# EasyEDA Pro project ProPrj_16-Sep-2025_2025-10-22.epro, schematic OURS PHONE_CONNECTORS_FLIP_2

## Sheets
1 CONNECTORS: Board Name: OURS PHONE_CONNECTORS_FLIP_2; Create Date: 2025-07-15; Page Name: CONNECTORS; Project Name: BackupProjects_abdulrehmanbinafsar_personal_0_20241230; Schematic Name: OURS PHONE_CONNECTORS_FLIP_2; Update Date: 2025-09-09; Add into BOM: yes; Company: Your Company; Convert to PCB: yes; Date: 2024-12-04; Draw By: Abdul Rehman; REV: 1.0; Sheet: 1/1
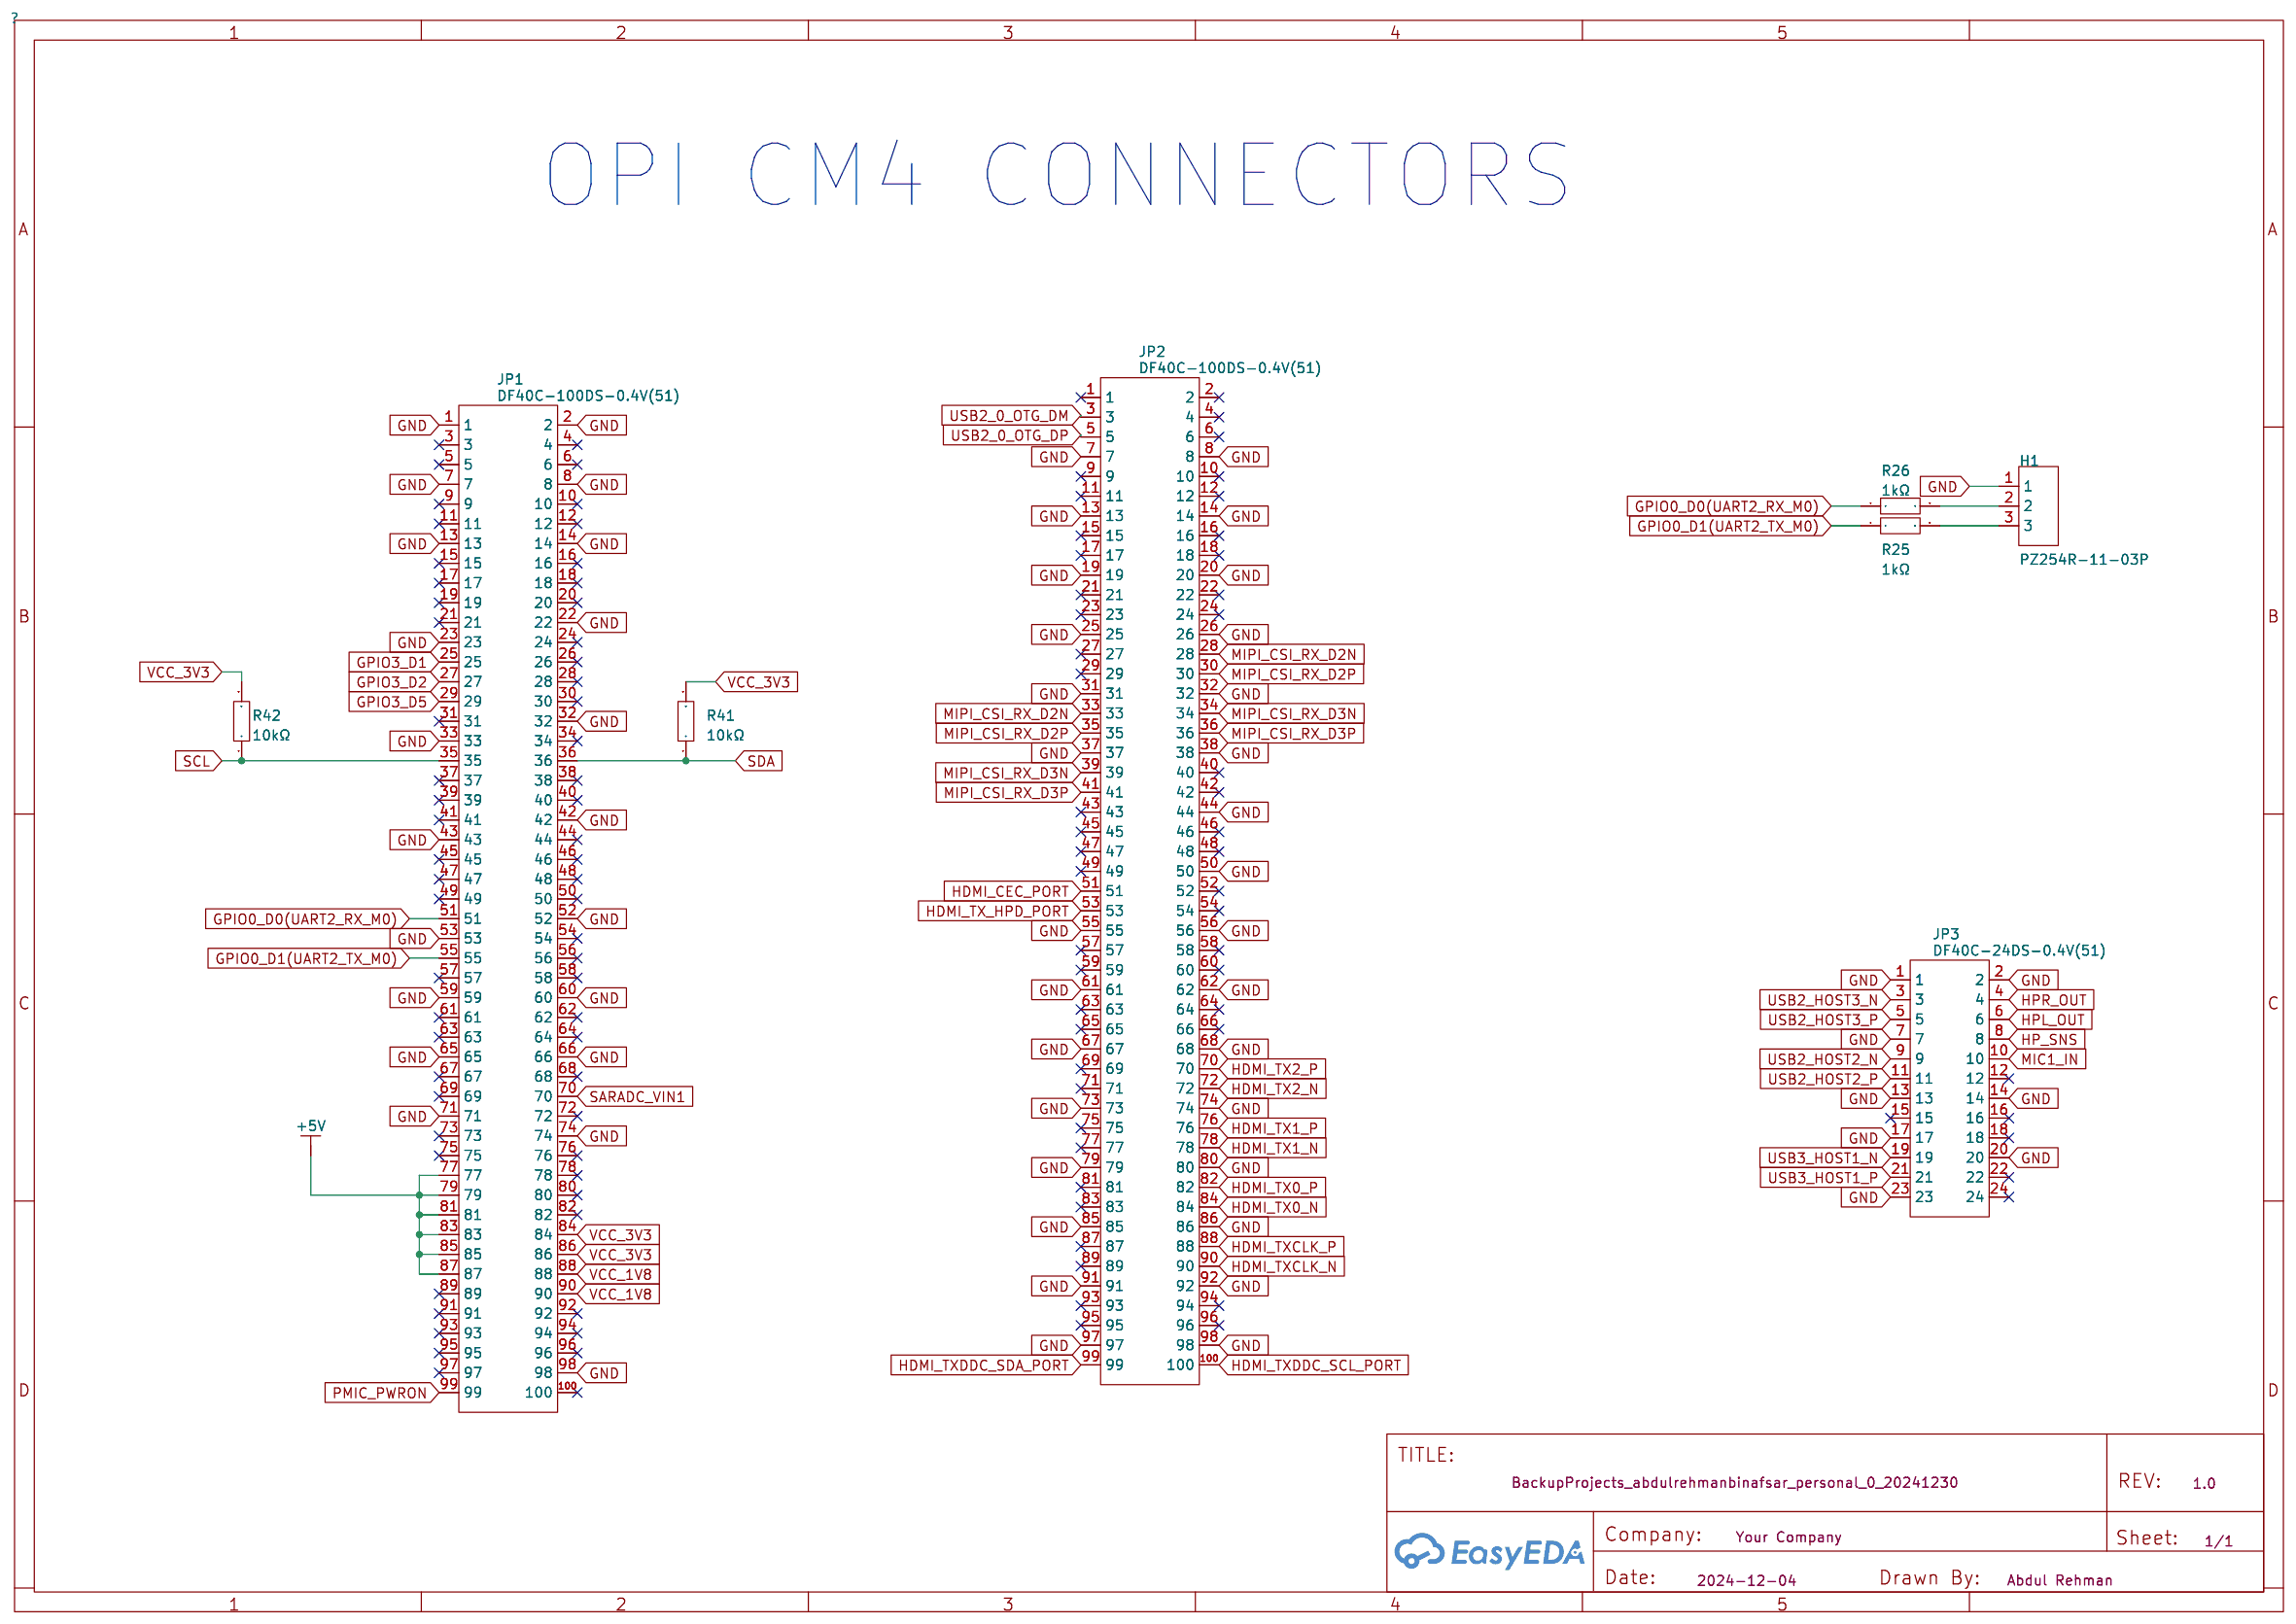
[diagram p0: CONNECTORS]
2 CIRCUITRY: Create Date: 2025-05-14; Page Name: CIRCUITRY; Update Date: 2025-05-29; Date: 2024-12-06
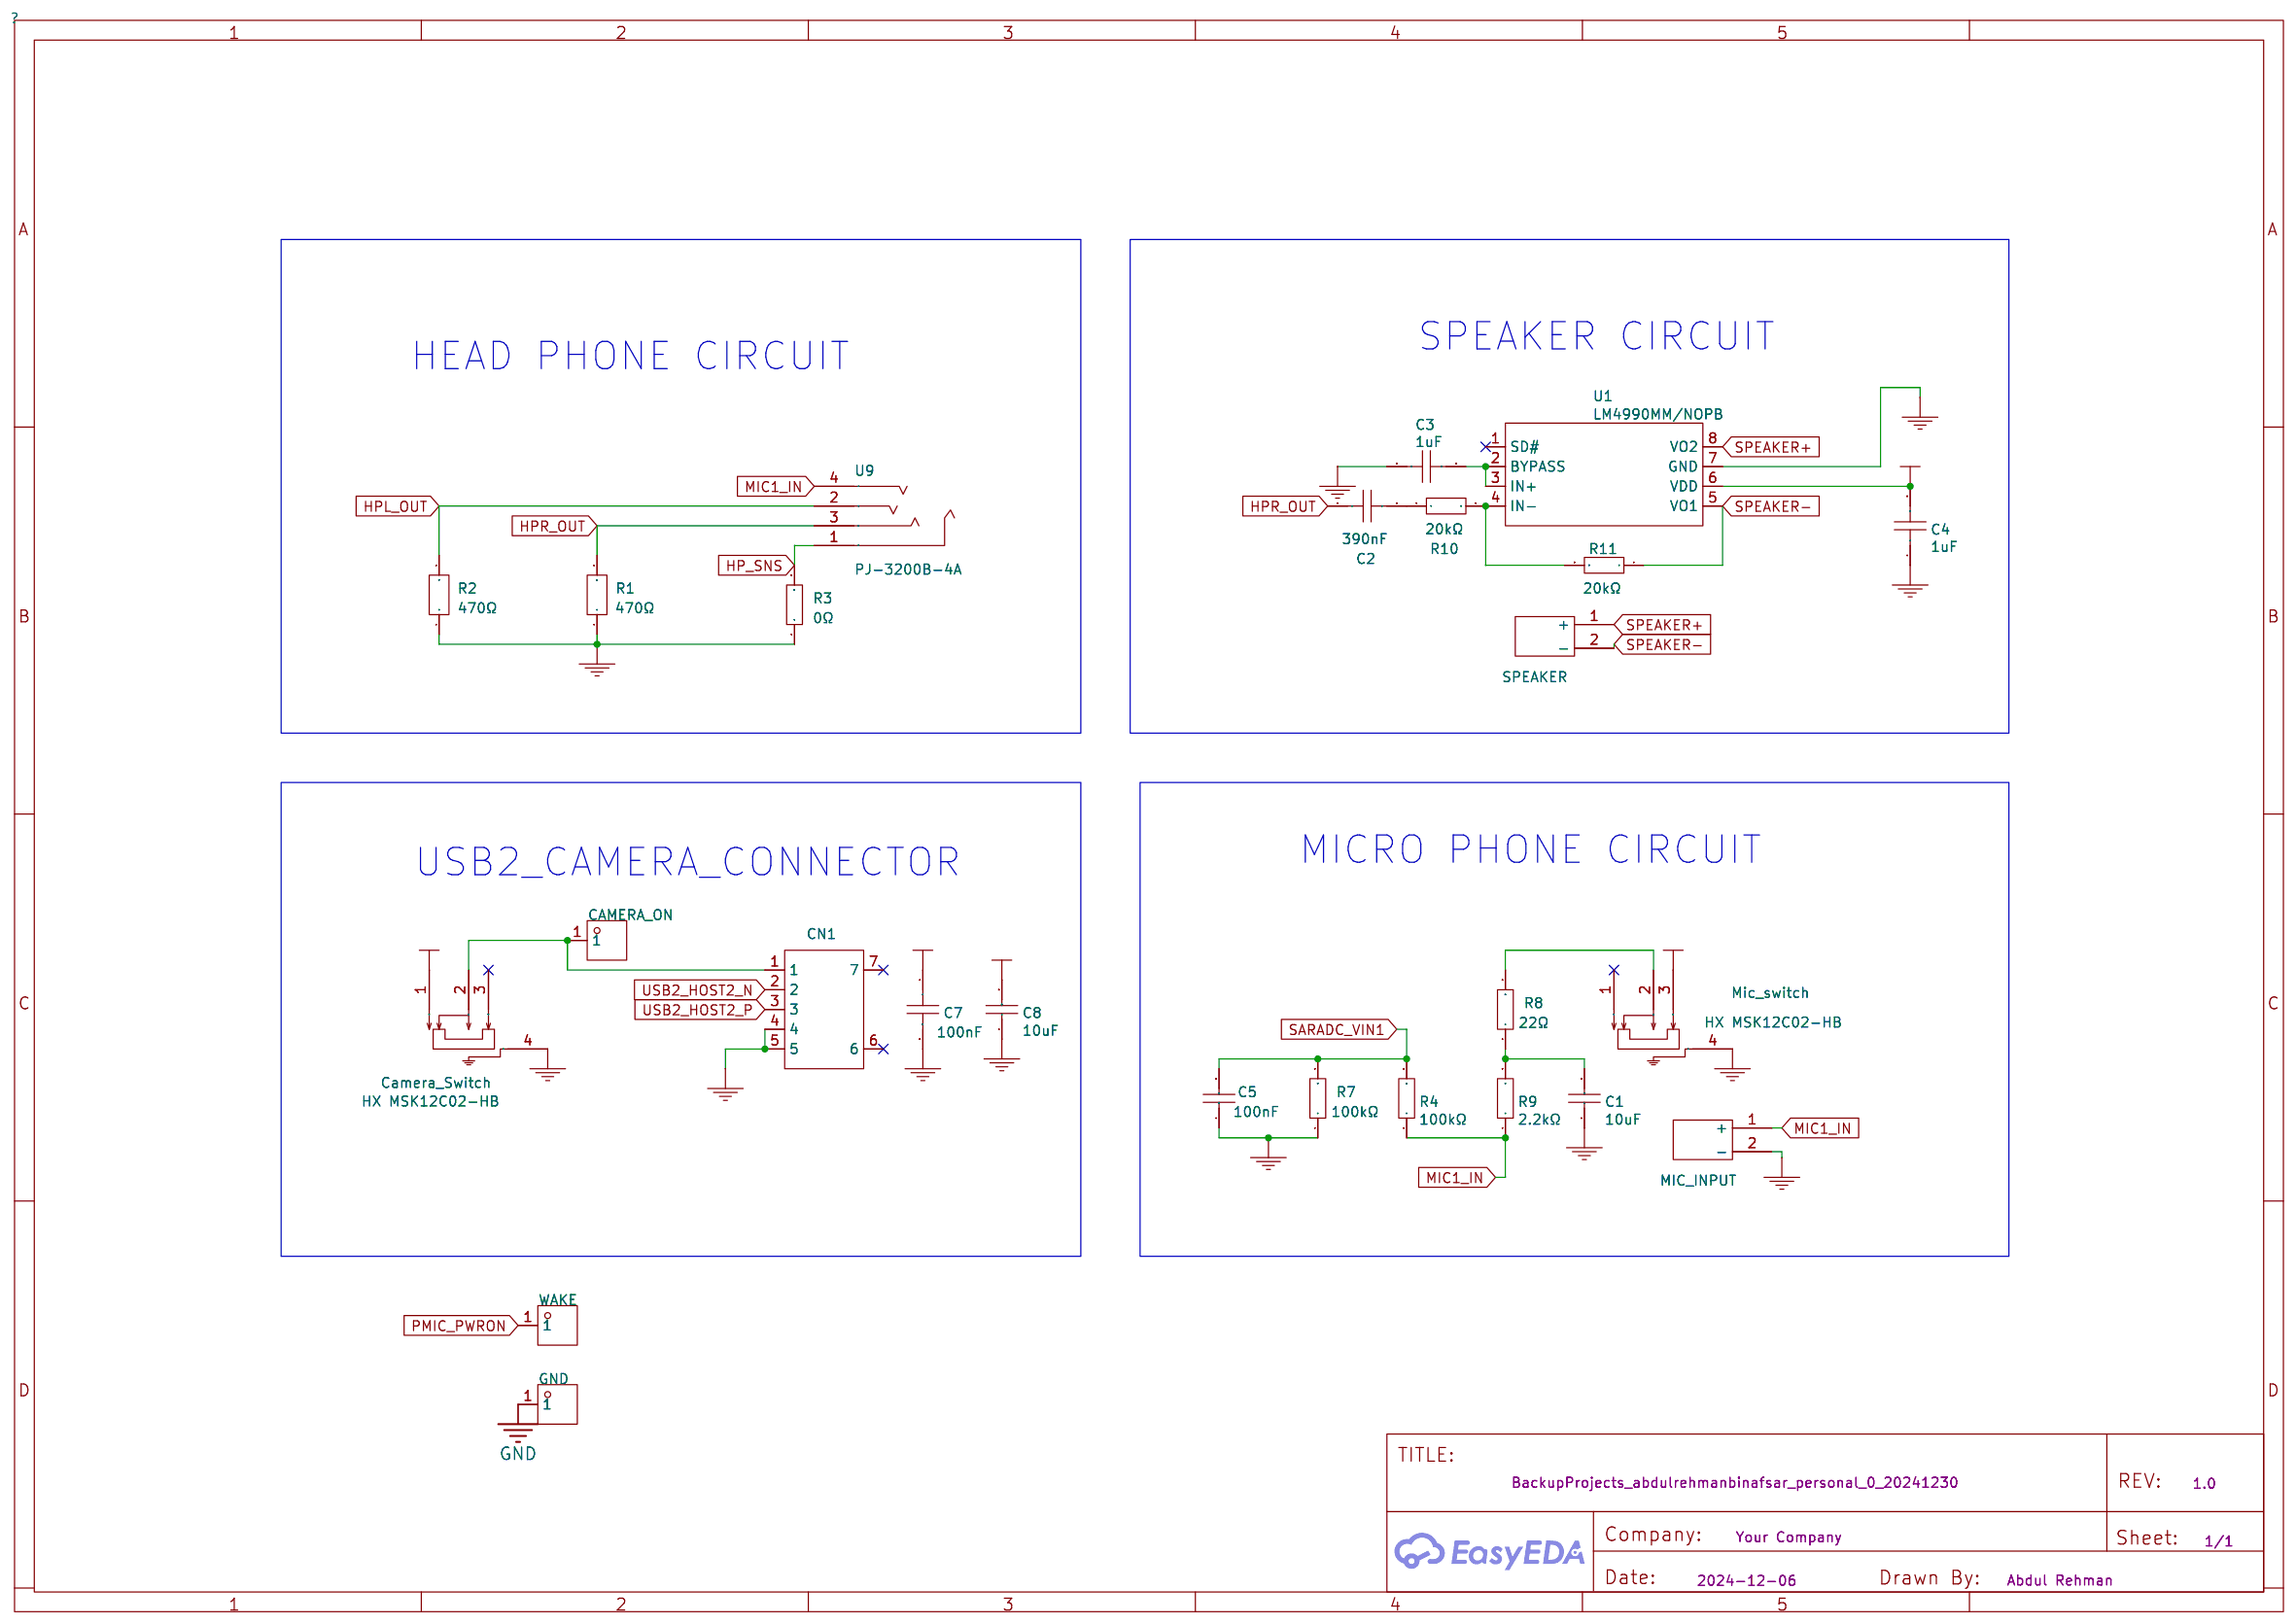
[diagram p1: CIRCUITRY]
3 SIM Module: Page Name: SIM Module; Update Date: 2025-07-15; Date: 2024-12-06
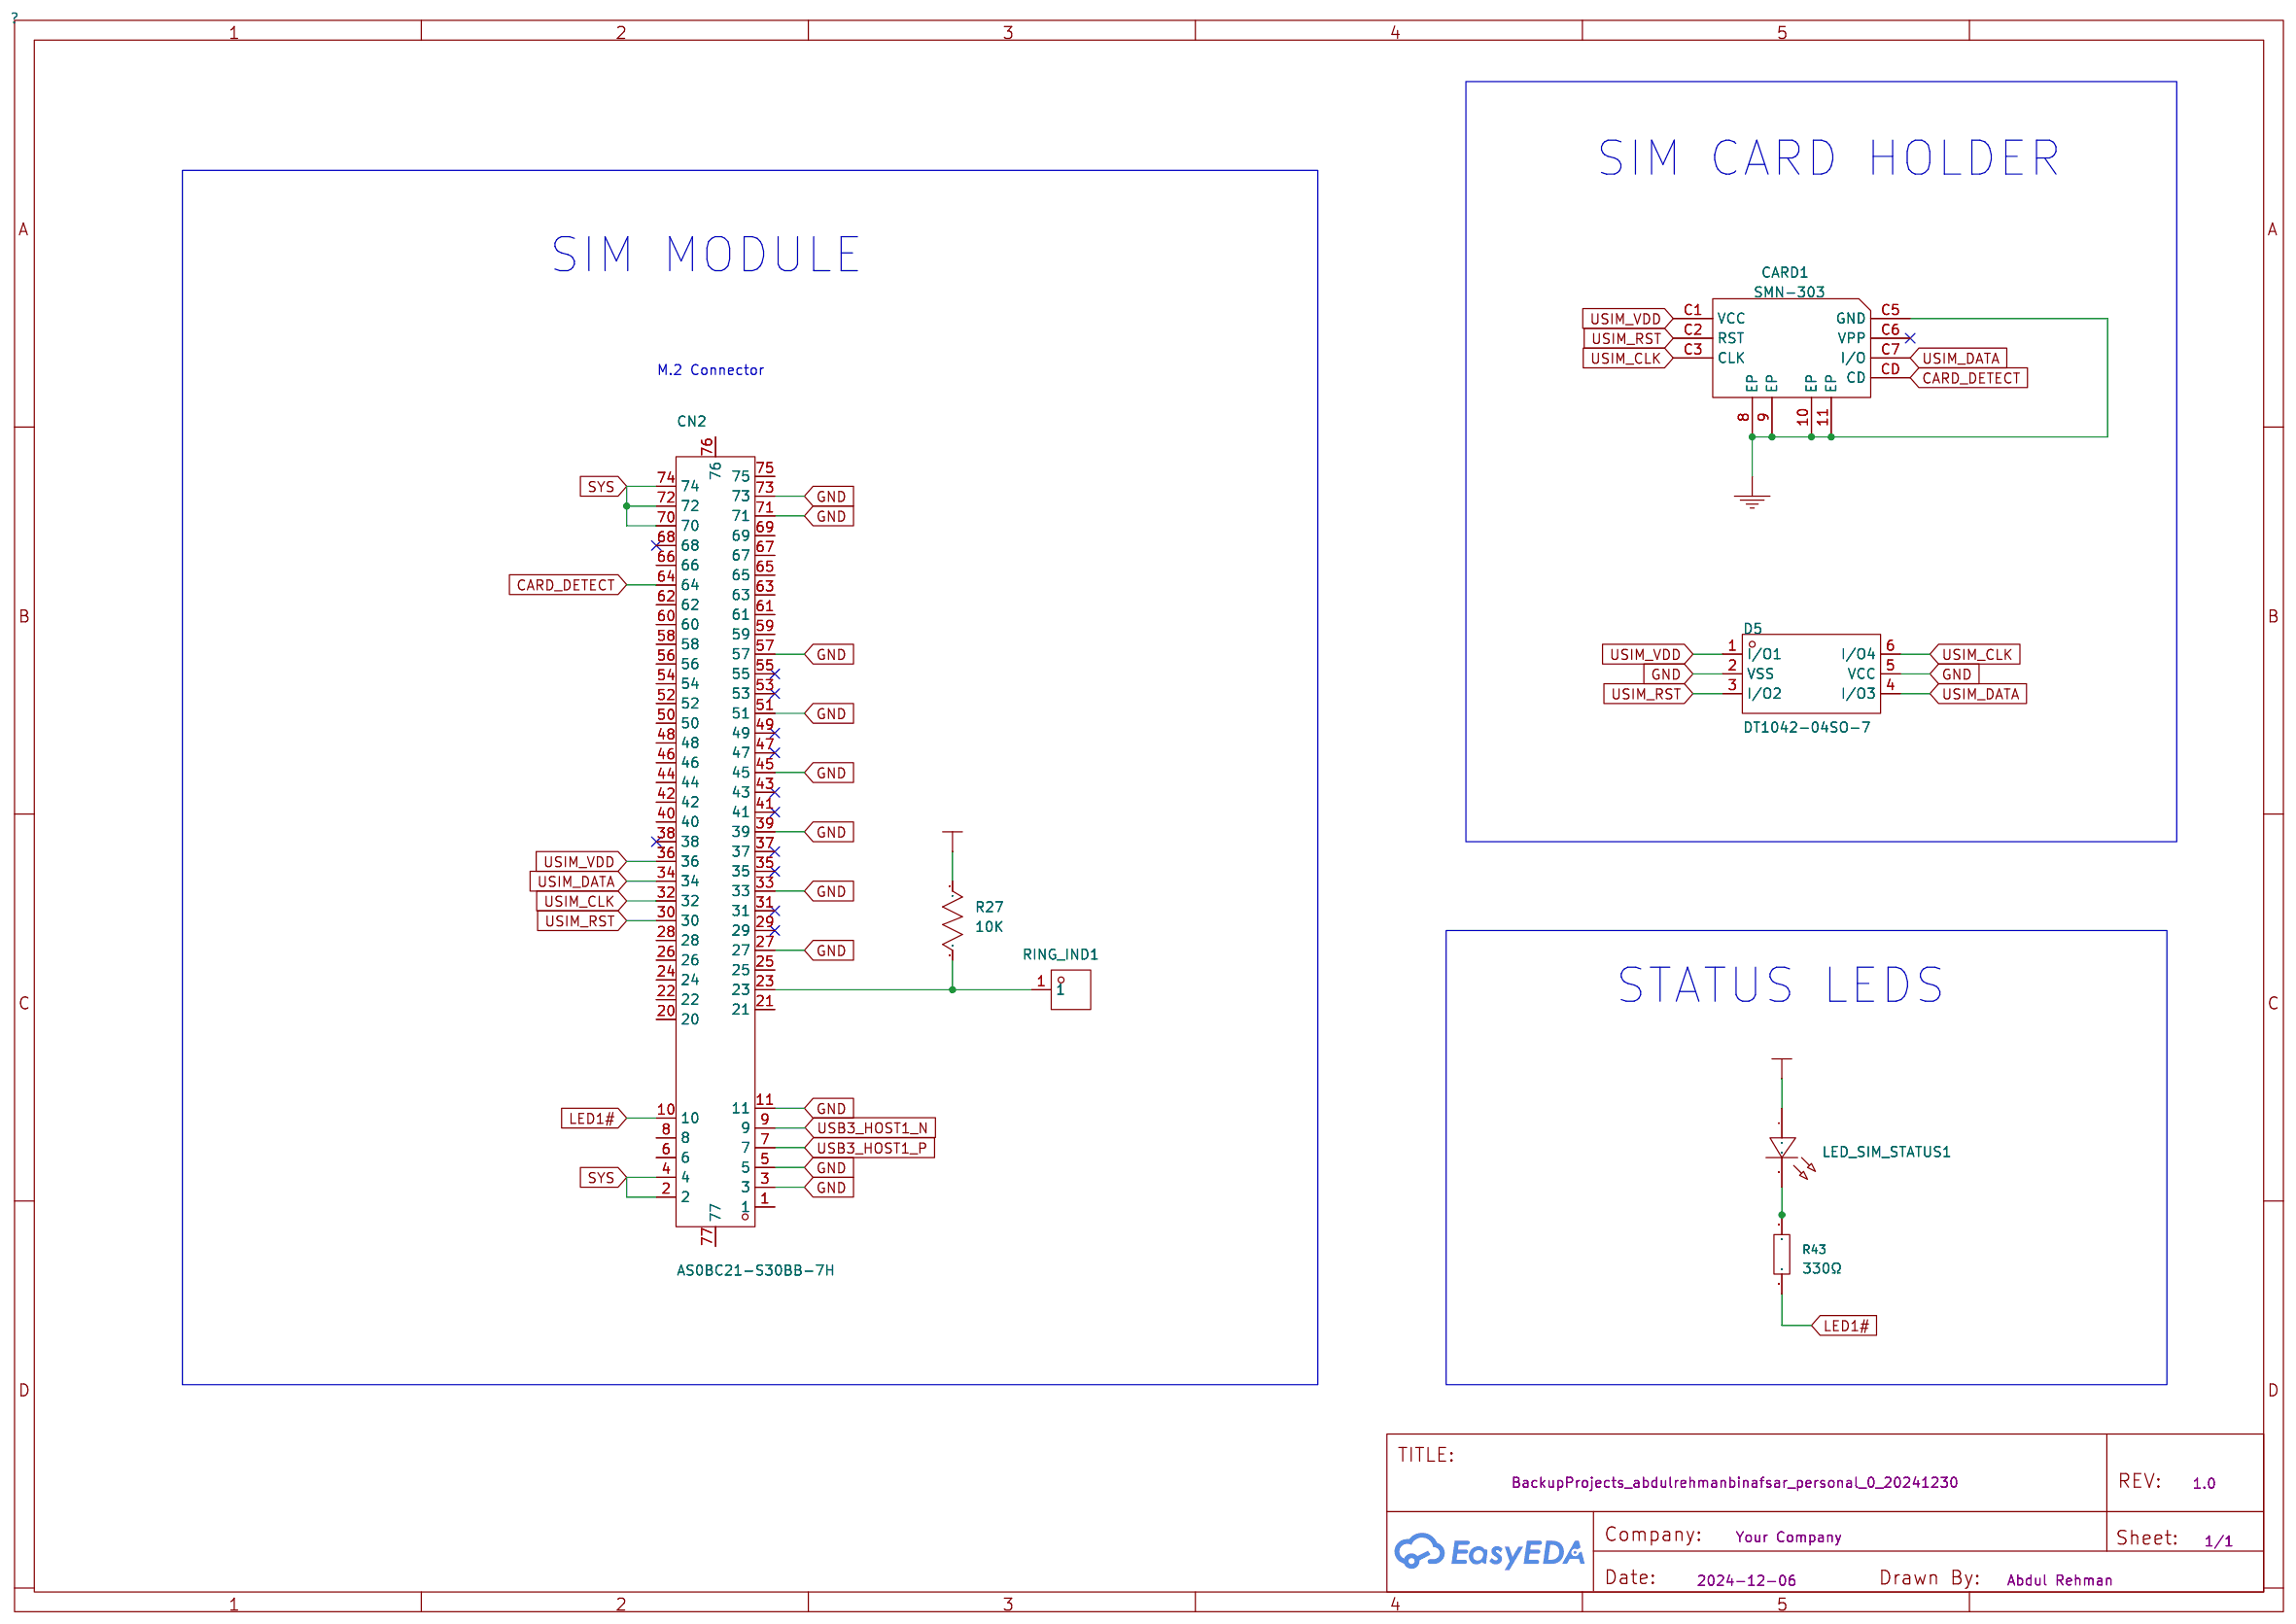
[diagram p2: SIM Module]
4 HDMI PORT: Create Date: 2025-05-14; Page Name: HDMI PORT; Update Date: 2025-05-29; Date: 2024-12-09
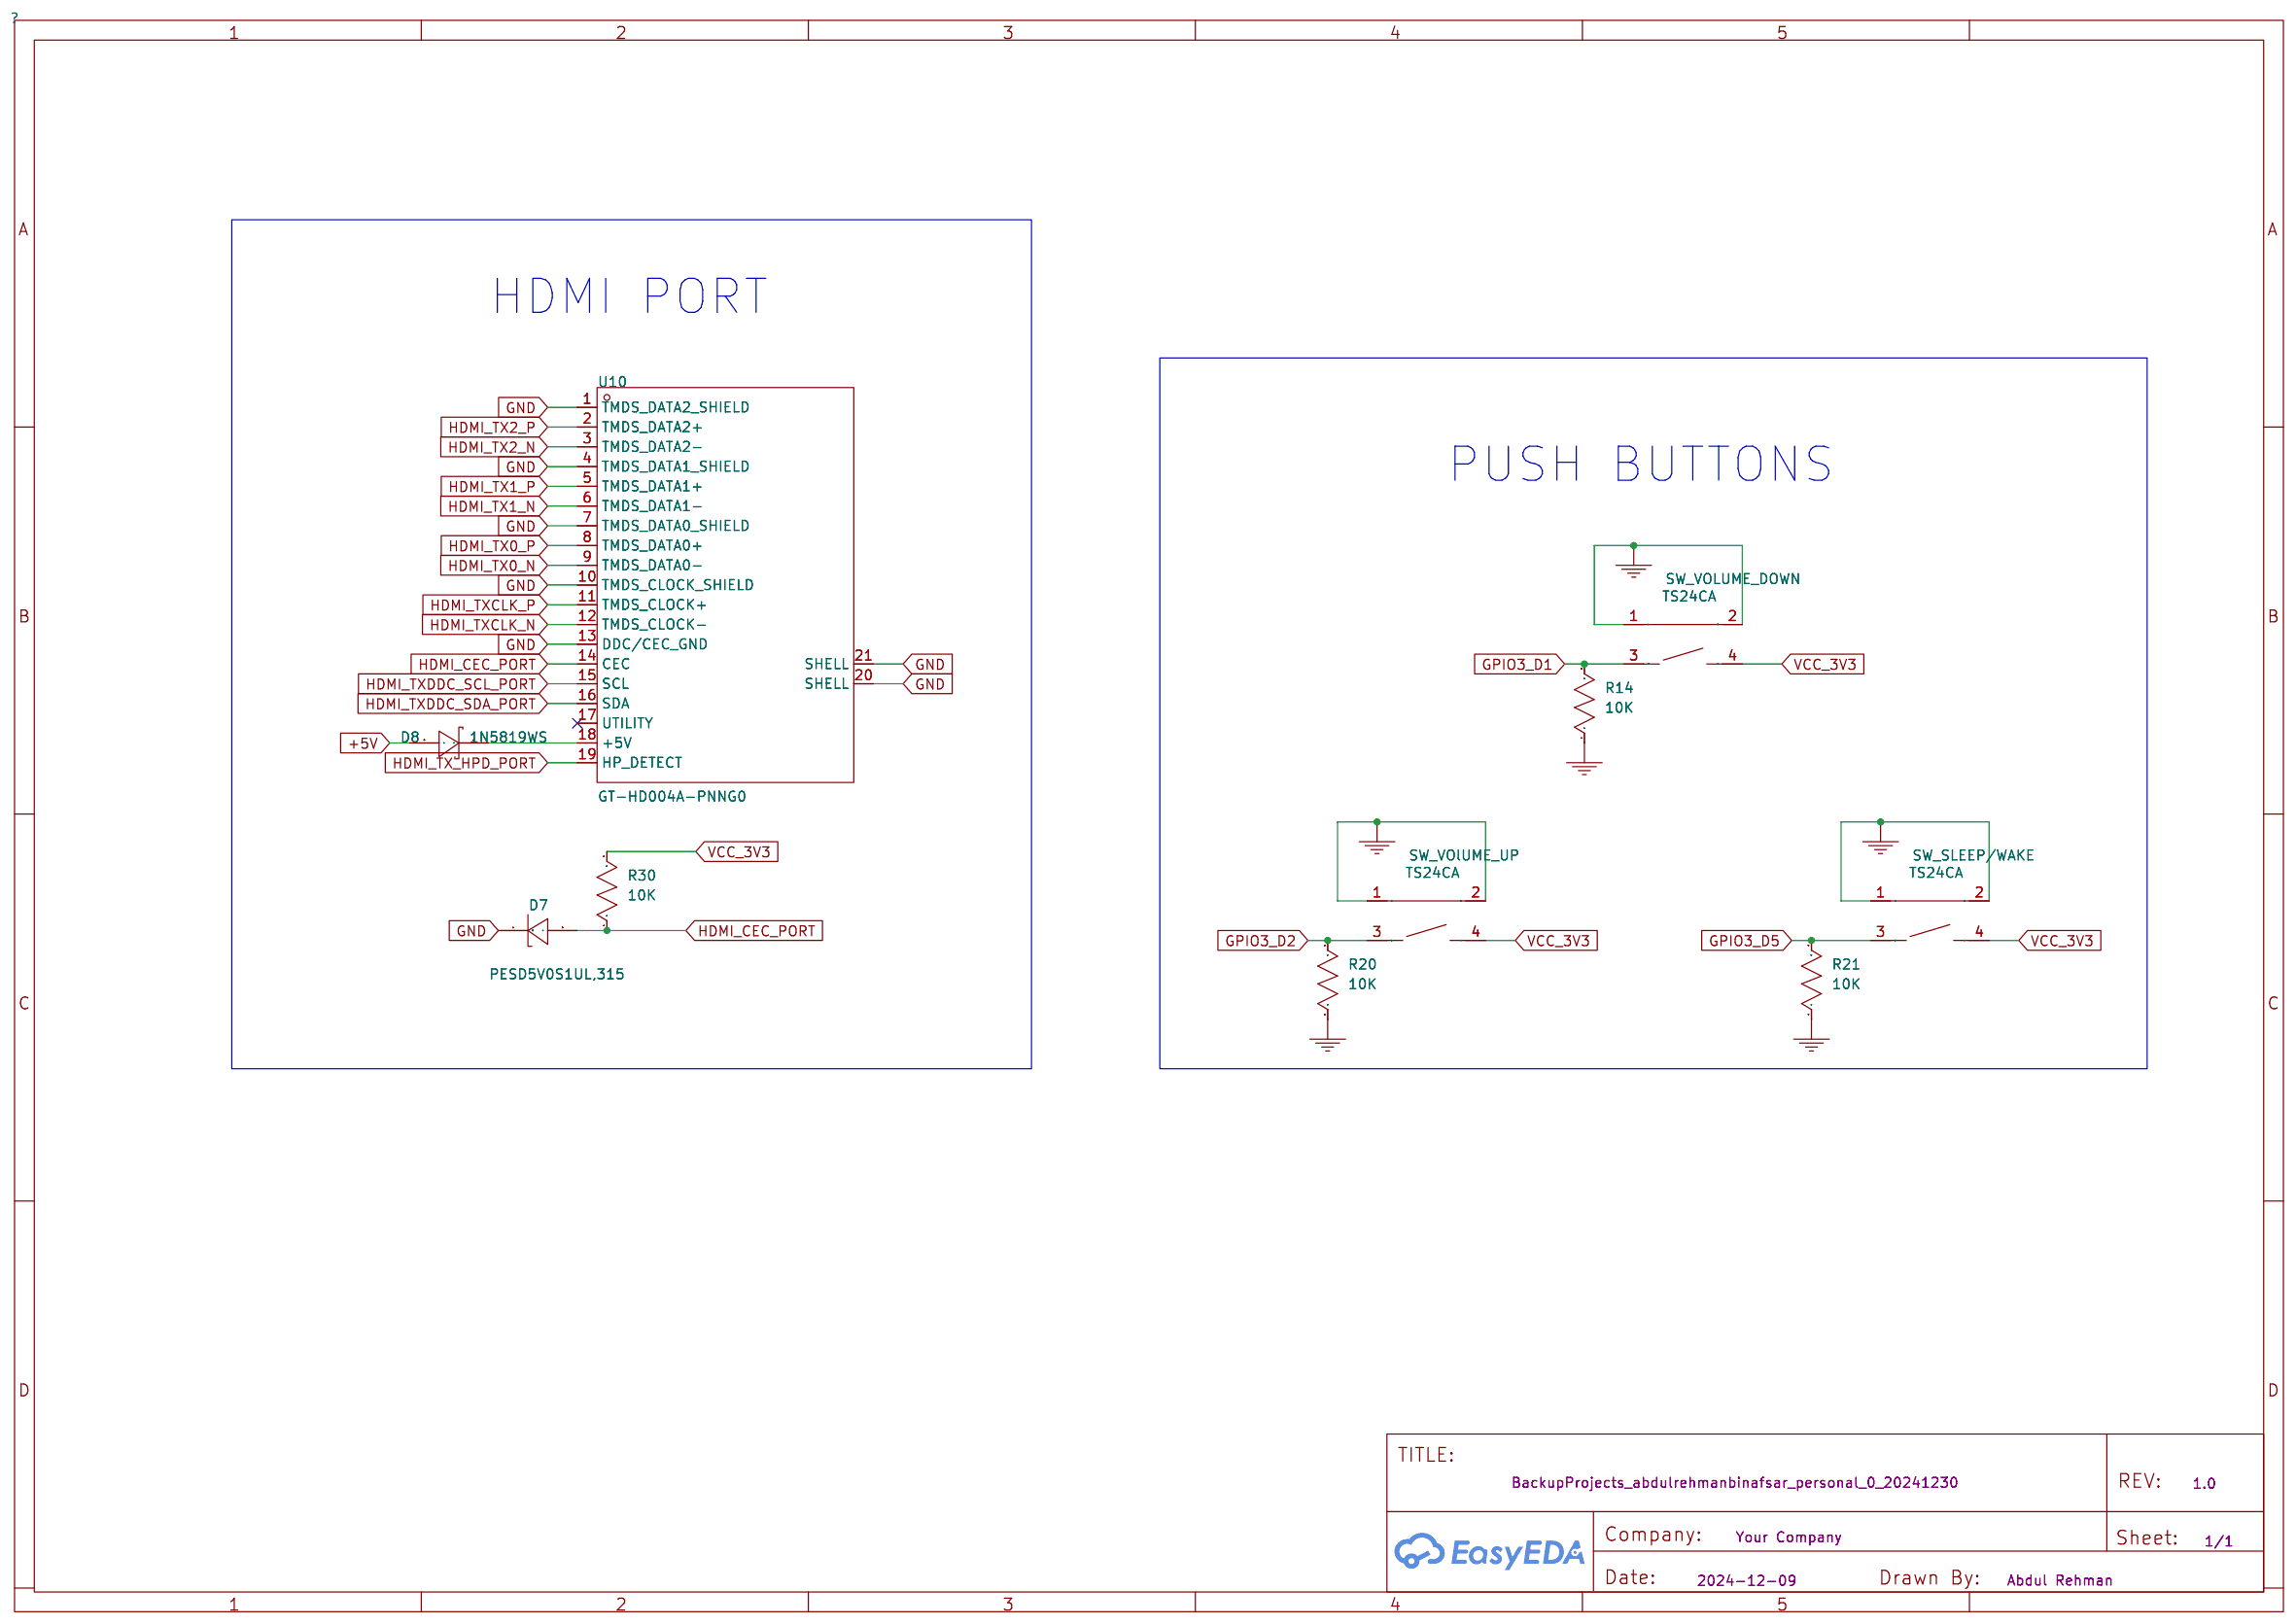
[diagram p3: HDMI PORT]
5 CPBR CIRCUIT: Page Name: CPBR CIRCUIT; Update Date: 2025-09-16; Company: EasyEDA.com; Page Size: A4; Version: V1.0
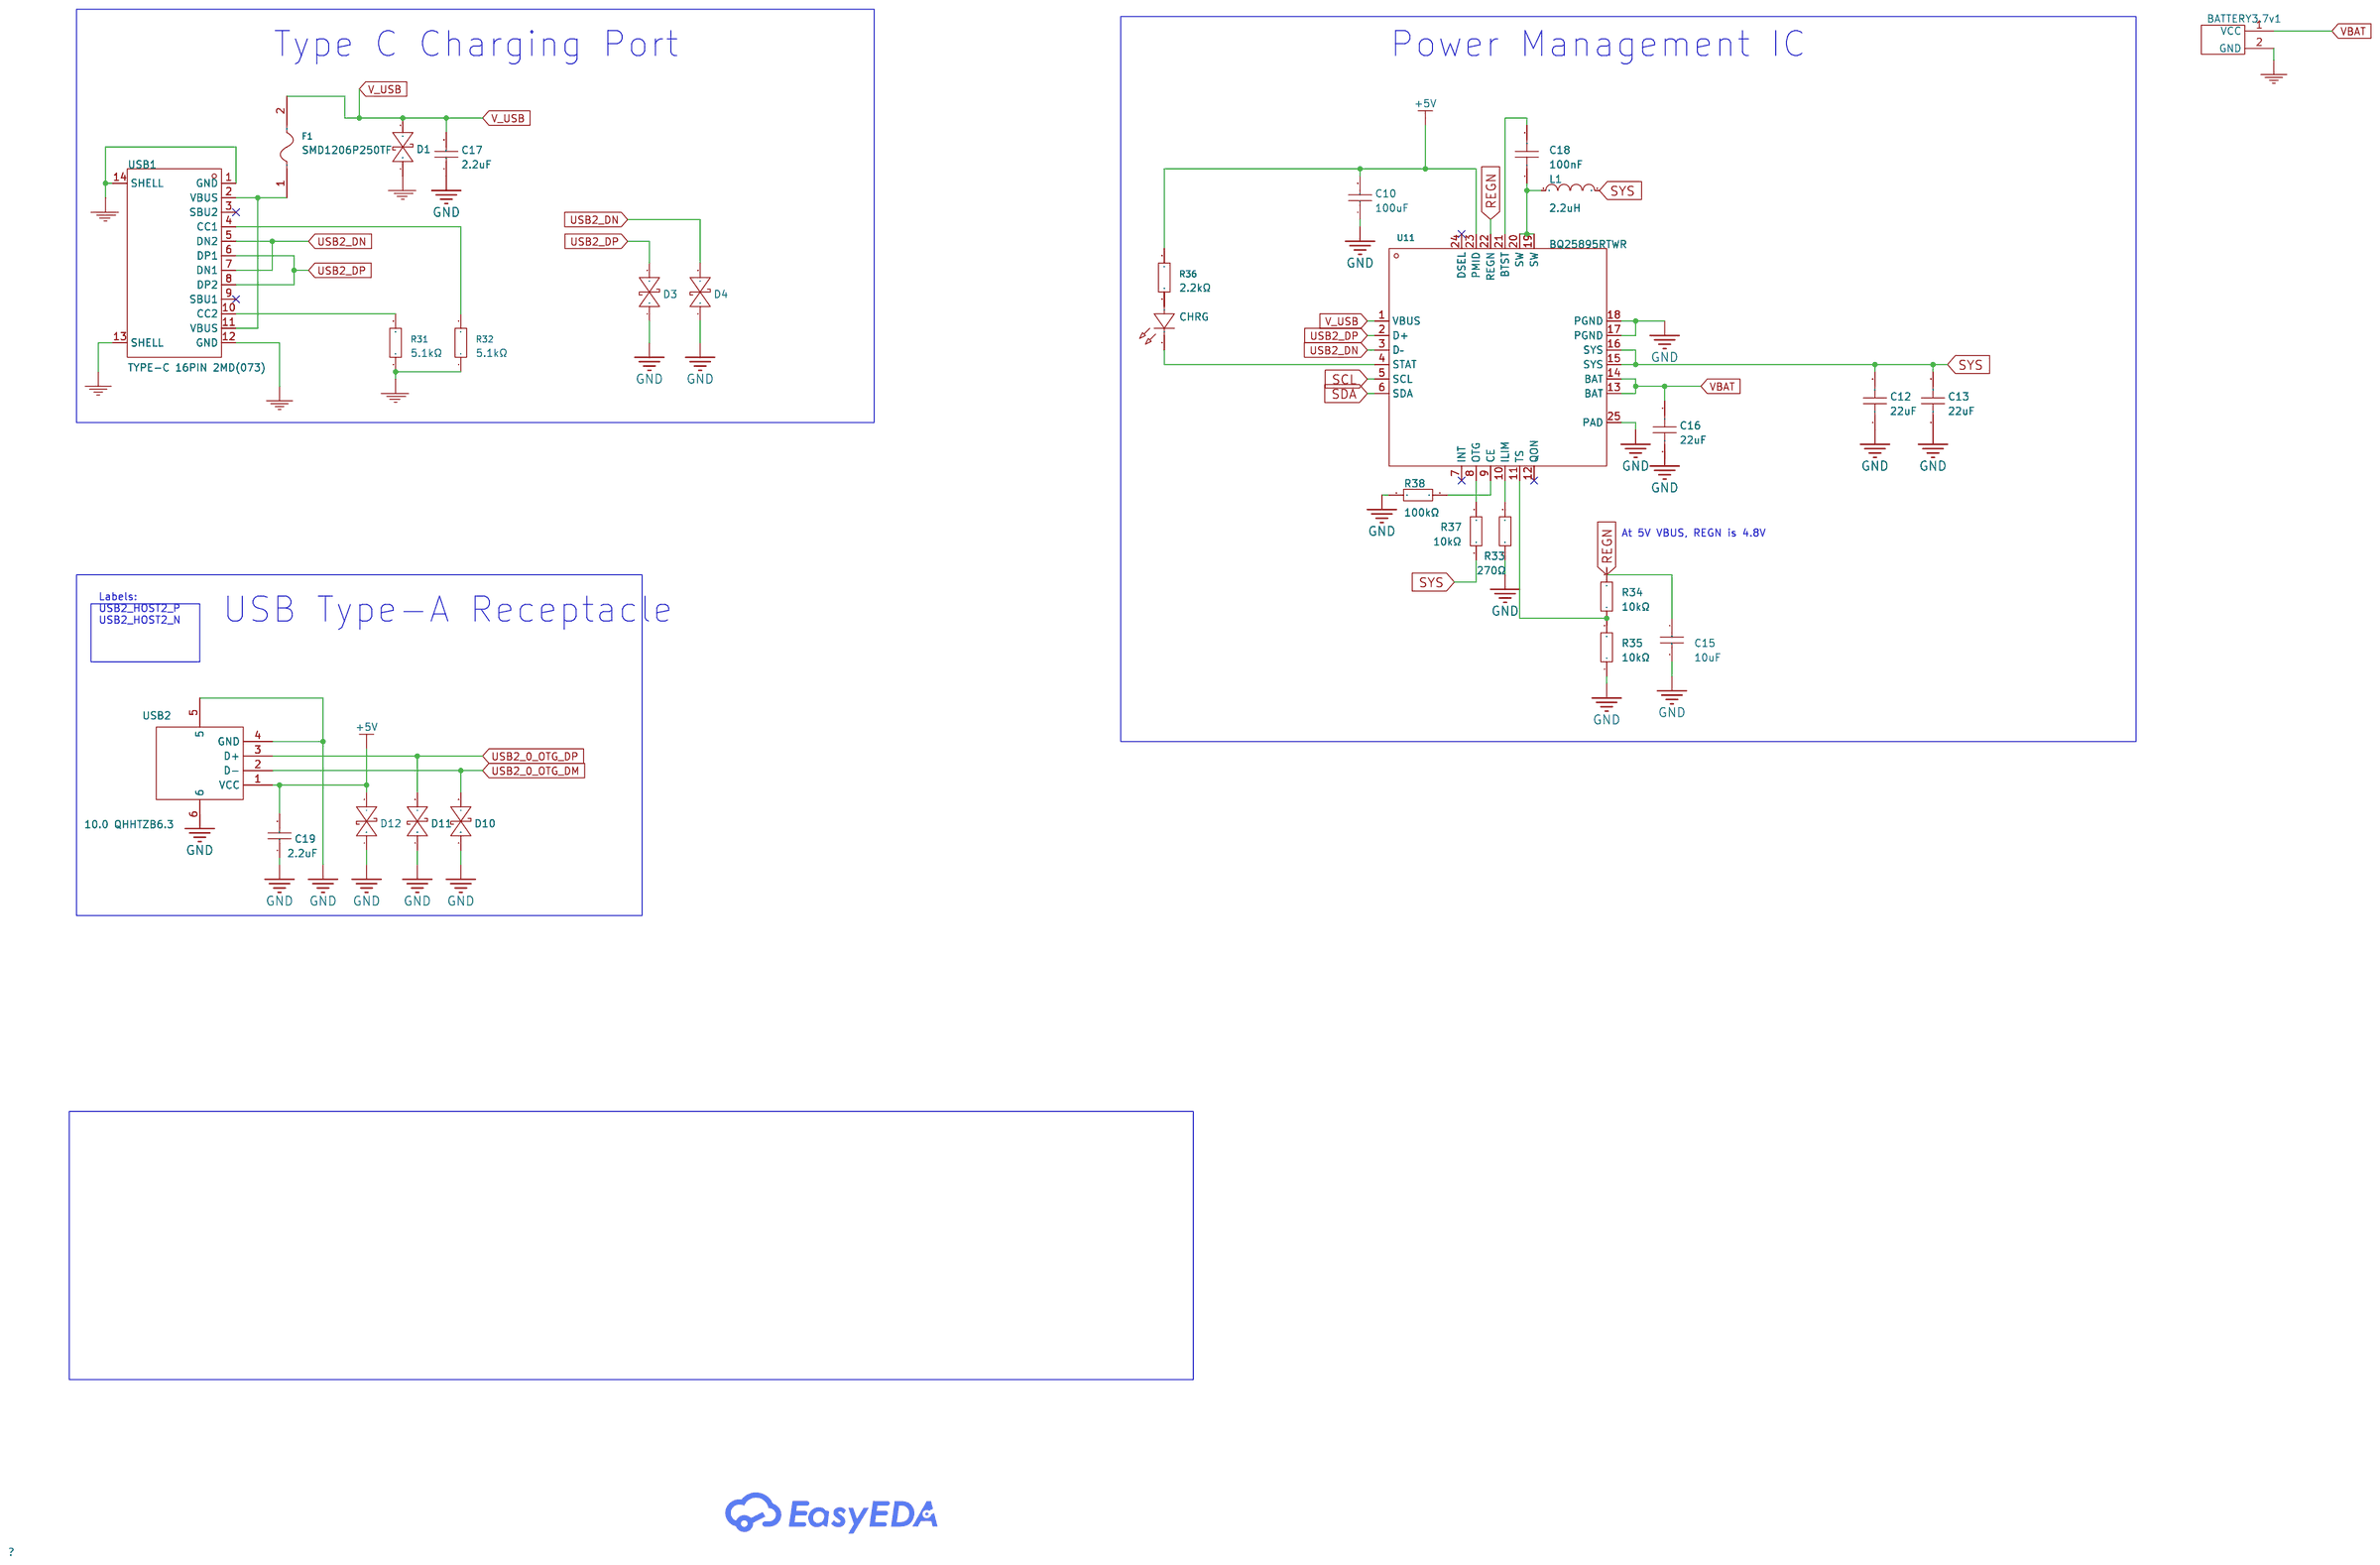
[diagram p4: CPBR CIRCUIT]

## Parts
sheet CIRCUITRY
C1  10uF  [C0402]
C2  390nF  [C0402]
C3  1uF  [C0402]
C4  1uF  [C0402]
C5  100nF  [C0402]
C7  100nF  [C0402]
C8  10uF  [C0402]
CAMERA_ON  TP-橘色测试点  [TESTPOINT-TH_BD3.2]  (no BOM)
Camera_Switch  HX MSK12C02-HB  [SW-SMD_MSK12C02-HB]
CN1  SM05B-SRSS-TB (LF)(SN)  [CONN-SMD_SM05B-SRSS-TB-LF-SN]
GND  TP-橘色测试点  [TESTPOINT-TH_BD3.2]  (no BOM)
MIC_INPUT  NOB  [BATTERY SYMBOL]  (no BOM)
Mic_switch  HX MSK12C02-HB  [SW-SMD_MSK12C02-HB]
R1  470Ω  [R0402]
R2  470Ω  [R0402]
R3  0Ω  [R0402]
R4  100kΩ  [R0402]
R7  100kΩ  [R0402]
R8  22Ω  [R0402]
R9  2.2kΩ  [R0402]
R10  20kΩ  [R0402]
R11  20kΩ  [R0402]
SPEAKER  NOB  [BATTERY SYMBOL]  (no BOM)
U1  LM4990MM/NOPB  [MSOP-8_L3.0-W3.0-P0.65-LS5.0-BL]
U9  PJ-3200B-4A  [AUDIO-TH_PJ-3200B-4A]
WAKE  TP-橘色测试点  [TESTPOINT-TH_BD3.2]  (no BOM)
sheet CONNECTORS
H1  PZ254R-11-03P  [HDR-TH_3P-P2.54-H-M-W10.4]
JP1  DF40C-100DS-0.4V(51)  [CONN-SMD_DF40C-100DS-0.4V-51]
JP2  DF40C-100DS-0.4V(51)  [CONN-SMD_DF40C-100DS-0.4V-51]
JP3  DF40C-24DS-0.4V(51)  [CONN-SMD_DF40C-24DS-0.4V51]
R25  1kΩ  [R0603]
R26  1kΩ  [R0603]
R41  10kΩ  [R0402]
R42  10kΩ  [R0402]
sheet CPBR CIRCUIT
BATTERY3.7v1  NOB  [BATTERY SYMBOL]  (no BOM)
C10  100uF  [C1206]
C12  22uF  [C0805]
C13  22uF  [C0805]
C15  10uF  [C0402]
C16  22uF  [C0805]
C17  2.2uF  [C0805]
C18  100nF  [C0402]
C19  2.2uF  [C0805]
CHRG  XL-1005UGC  [LED0402-RD_GREEN]
D1  AZ5825-01F  [DFN-2L_L1.0-W0.6-P0.65-BI]
D3  AZ5825-01F  [DFN-2L_L1.0-W0.6-P0.65-BI]
D4  AZ5825-01F  [DFN-2L_L1.0-W0.6-P0.65-BI]
D10  AZ5825-01F  [DFN-2L_L1.0-W0.6-P0.65-BI]
D11  AZ5825-01F  [DFN-2L_L1.0-W0.6-P0.65-BI]
D12  AZ5825-01F  [DFN-2L_L1.0-W0.6-P0.65-BI]
F1  SMD1206P250TF  [F1206]
L1  2.2uH  [IND-SMD_L4.4-W4.2]
R31  5.1kΩ  [R0402]
R32  5.1kΩ  [R0402]
R33  270Ω  [R0402]
R34  10kΩ  [R0402]
R35  10kΩ  [R0402]
R36  2.2kΩ  [R0402]
R37  10kΩ  [R0402]
R38  100kΩ  [R0402]
U11  BQ25895RTWR  [QFN-24_L4.0-W4.0-P0.50-TL-EP2.7]
USB1  TYPE-C 16PIN 2MD(073)  [USB-C-SMD_TYPE-C-6PIN-2MD-073]
USB2  10.0 QHHTZB6.3  [USB-A-TH_10.0QHHTZB6.3]
sheet HDMI PORT
D7  PESD5V0S1UL,315  [SOD-882_L1.0-W0.6-RD]
D8  1N5819WS  [SOD-323_L1.8-W1.3-LS2.5-RD]
R14  10K  [R0603]
R20  10K  [R0603]
R21  10K  [R0603]
R30  10K  [R0603]
SW_SLEEP/WAKE  TS24CA  [SW-SMD_TS24CA]
SW_VOLUME_DOWN  TS24CA  [SW-SMD_TS24CA]
SW_VOlUME_UP  TS24CA  [SW-SMD_TS24CA]
U10  GT-HD004A-PNNG0  [HDMI-SMD_GT-HD004A-FNNG0]
sheet SIM Module
CARD1  SMN-303  [SIM-SMD_SMN-303]
CN2  AS0BC21-S30BB-7H  [CONN-SMD_AS0BC21-S30BB-7H]
D5  DT1042-04SO-7  [SOT-26_L3.0-W1.6-P0.95-LS2.8-BL]
LED_SIM_STATUS1  LED-0805_B  [LED0805_BLUE]
R27  10K  [R0603]
R43  330Ω  [R0805]
RING_IND1  TP-橘色测试点  [TESTPOINT-TH_BD3.2]  (no BOM)

## Library data of the parts
C1 C8 = 10uF: Supplier: LCSC; Manufacturer: YAGEO(国巨); Manufacturer Part: CL05A106MQ5NUNC; Supplier Part: C15525; JLCPCB Part Class: Extended Part; Check: true
C2 = 390nF: Supplier: LCSC; Supplier Part: C7393858; Manufacturer: CCTC(三环); Manufacturer Part: TCC0402X5R394K160AT; JLCPCB Part Class: Extended Part; Check: true
C3 C4 = 1uF: Supplier: LCSC; Supplier Part: C318573; Manufacturer: SAMSUNG(三星); Manufacturer Part: CL05A105MQ5NNNC; JLCPCB Part Class: Extended Part; Check: true
C5 = 100nF: Supplier: LCSC; Supplier Part: C106204; Manufacturer: YAGEO(国巨); Manufacturer Part: CC0402KRX5R7BB104; JLCPCB Part Class: Extended Part; Check: true
C7 = 100nF: Supplier: LCSC; Supplier Part: C576741; Manufacturer: YAGEO(国巨); Manufacturer Part: CC0402MRX5R7BB104; JLCPCB Part Class: Extended Part; Check: true
CAMERA_ON GND RING_IND1 WAKE = TP-橘色测试点: Supplier Part: C9900007421; Supplier Footprint: TESTPOINT-TH_BD-2P-P2.00; JLCPCB Part Class: Extended Part; Supplier: LCSC; Check: true
Camera_Switch Mic_switch = HX MSK12C02-HB: Supplier: LCSC; Supplier Part: C5149817; Manufacturer: hanxia(韩下); JLCPCB Part Class: Extended Part; Check: true
CN1 = SM05B-SRSS-TB (LF)(SN): Supplier: LCSC; Supplier Part: C136657; Manufacturer: JST; Manufacturer Part: SM05B-SRSS-TB(LF)(SN); JLCPCB Part Class: Extended Part; Check: true
BATTERY3.7v1 MIC_INPUT SPEAKER = NOB: Check: true
R1 R2 = 470Ω: Supplier: LCSC; Supplier Part: C881295; Manufacturer: EVER OHMS(天二科技); Manufacturer Part: CR0402J470RQ10Z; JLCPCB Part Class: Extended Part; Check: true
R3 = 0Ω: Supplier: LCSC; Supplier Part: C17168; Manufacturer: UNI-ROYAL(Uniroyal Elec); Manufacturer Part: 0402WGF0000TCE; JLCPCB Part Class: Extended Part; Check: true
R4 R7 = 100kΩ: Supplier: LCSC; Manufacturer: YAGEO(国巨); Manufacturer Part: AC0402JR-07100KL; Supplier Part: C144732; JLCPCB Part Class: Extended Part; Check: true
R8 = 22Ω: Supplier: LCSC; Supplier Part: C25092; Manufacturer: UNI-ROYAL(Uniroyal Elec); Manufacturer Part: 0402WGF220JTCE; JLCPCB Part Class: Extended Part; Check: true
R9 = 2.2kΩ: Supplier: LCSC; Supplier Part: C269678; Manufacturer: Tyohm(幸亚电阻); Manufacturer Part: RMC04022.2K5%N; JLCPCB Part Class: Extended Part; Check: true
R10 R11 = 20kΩ: Supplier: LCSC; Manufacturer: YAGEO(国巨); Manufacturer Part: RC0402FR-0720KL; Supplier Part: C93942; JLCPCB Part Class: Extended Part; Check: true
U1 = LM4990MM/NOPB: Supplier: LCSC; Manufacturer: TI(德州仪器); Supplier Part: C8958; JLCPCB Part Class: Extended Part; Check: true
U9 = PJ-3200B-4A: Connector Type:3.5mm耳机座 Current Rating (Max):500mA Voltage Rating (Max):30V; LCSC Part Name: 3.5mm耳机座; Supplier Part: C136687; Manufacturer: 韩国韩荣; Supplier Footprint: 插件; JLCPCB Part Class: Extended Part; Datasheet: https://atta.szlcsc.com/upload/public/pdf/source/20210429/C136687_4CC2DC59D4F83D423B9C10D95C628283.pdf; Supplier: LCSC; Connector Type: 3.5mm耳机座; Current Rating (Max): 500mA; Voltage Rating (Max): 30V; Check: true
H1 = PZ254R-11-03P: Pin Structure:1x3P Pitch:2.54mm Row Spacing:- Circluar Pins/Square Pins:Policy Mounting Type:Right-Angle Number of Rows:Single Row Number of Pins:3P Current Rating:- Voltage Rating (Max):- Length of Mating Pin:6mm Insulation Height:2.5mm Contact Material:; LCSC Part Name: 1x3P 间距:2.54mm 方针 弯插; Supplier Part: C492411; Manufacturer: XFCN(兴飞); Supplier Footprint: 弯插,P=2.54mm; JLCPCB Part Class: Extended Part; Datasheet: https://atta.szlcsc.com/upload/public/pdf/source/20200309/C492411_5256E8AAA7569F6D33B6ADBFAE4F2888.pdf; Supplier: LCSC; Pin Structure: 1x3P; Pitch: 2.54mm; Circluar Pins/Square Pins: Policy; Mounting Type: Right-Angle; Number of Rows: Single Row; Number of Pins: 3P; Length of Mating Pin: 6mm; Insulation Height: 2.5mm; Contact Material: Brass; Operating Temperature: -40℃~+105℃; Color: Black; Check: true
JP1 JP2 = DF40C-100DS-0.4V(51): Supplier: LCSC; Supplier Part: C597931; Manufacturer: HRS(广濑); JLCPCB Part Class: Extended Part; Check: true
JP3 = DF40C-24DS-0.4V(51): Supplier: LCSC; Supplier Part: C424640; Manufacturer: HRS(广濑); JLCPCB Part Class: Extended Part; Check: true
R25 R26 = 0603WAF1001T5E: Type:Thick Film Resistors Resistance:1kΩ Tolerance:±1% Tolerance:±1% Power(Watts): Overload Voltage (Max): Temperature Coefficient:±100ppm/℃ Temperature Coefficient:±100ppm/℃ Operating Temperature Range:-55℃~+155℃ Operating Temperature Range:-55℃~+155℃; LCSC Part Name: 1kΩ ±1% 100mW 厚膜电阻; Supplier Part: C21190; Manufacturer: UNI-ROYAL(厚声); Supplier Footprint: 0603; JLCPCB Part Class: Basic Part; Datasheet: https://atta.szlcsc.com/upload/public/pdf/source/20200306/C422600_1E6D84923E4A46A82E41ADD87F860B5C.pdf; Supplier: LCSC; Type: Thick Film Resistors; Tolerance: ±1%; Temperature Coefficient: ±100ppm/℃; Operating Temperature Range: -55℃~+155℃; Check: true
R34 R35 R37 R41 R42 = 0402WGF1002TCE: Type:Thick Film Resistor Resistance:10kΩ Tolerance:±1% Tolerance:±1% Power(Watts):62.5mW Voltage-Supply(Max):50V Temperature Coefficient:±100ppm/℃ Temperature Coefficient:±100ppm/℃ Operating Temperature:-55℃~+155℃ Operating Temperature:-55℃~+155℃; LCSC Part Name: 10kΩ ±1% 62.5mW 厚膜电阻; Supplier Part: C25744; Manufacturer: UNI-ROYAL(厚声); Supplier Footprint: 0402; JLCPCB Part Class: Basic Part; Datasheet: https://item.szlcsc.com/datasheet/0402WGF1002TCE/26487.html; Supplier: LCSC; Type: Thick Film Resistor; Tolerance: ±1%; Power(Watts): 62.5mW; Voltage-Supply(Max): 50V; Temperature Coefficient: ±100ppm/℃; Operating Temperature: -55℃~+155℃
C10 = CL31A107MQHNNNE: Capacitance:100uF Tolerance:±20% Tolerance:±20% Voltage Rating:6.3V Temperature Coefficient:X5R; LCSC Part Name: 100uF ±20% 6.3V; Supplier Part: C15008; Manufacturer: SAMSUNG(三星); Supplier Footprint: 1206; JLCPCB Part Class: Basic Part; Datasheet: https://item.szlcsc.com/datasheet/CL31A107MQHNNNE/15681.html; Supplier: LCSC; Tolerance: ±20%; Voltage Rating: 6.3V; Temperature Coefficient: X5R
C12 C13 C16 = CL21A226MAYNNNE: Capacitance:22uF Tolerance:±20% Tolerance:±20% Voltage Rating:25V Temperature Coefficient:X5R; LCSC Part Name: 22uF ±20% 25V; Supplier Part: C602037; Manufacturer: SAMSUNG(三星); Supplier Footprint: 0805; JLCPCB Part Class: Extended Part; Datasheet: https://item.szlcsc.com/datasheet/CL21A226MAYNNNE/631473.html; Supplier: LCSC; Tolerance: ±20%; Voltage Rating: 25V; Temperature Coefficient: X5R
C15 = CL05A106MQ5NUNC: Capacitance:10uF Tolerance:±20% Tolerance:±20% Voltage Rating:6.3V Temperature Coefficient:X5R; LCSC Part Name: 10uF ±20% 6.3V; Supplier Part: C15525; Manufacturer: SAMSUNG(三星); Supplier Footprint: 0402; JLCPCB Part Class: Basic Part; Datasheet: https://item.szlcsc.com/datasheet/CL05A106MQ5NUNC/16204.html; Supplier: LCSC; Tolerance: ±20%; Voltage Rating: 6.3V; Temperature Coefficient: X5R
C17 C19 = CL21B225KAFNNNE: Capacitance:2.2uF Tolerance:±10% Tolerance:±10% Voltage Rating:25V Temperature Coefficient:X7R; LCSC Part Name: 2.2uF ±10% 25V; Supplier Part: C19110; Manufacturer: SAMSUNG(三星); Supplier Footprint: 0805; JLCPCB Part Class: Extended Part; Datasheet: https://item.szlcsc.com/datasheet/CL21B225KAFNNNE/19814.html; Supplier: LCSC; Tolerance: ±10%; Voltage Rating: 25V; Temperature Coefficient: X7R
C18 = CL05B104KO5NNNC: Capacitance: Tolerance:±10% Tolerance:±10% Voltage Rated: Temperature Coefficient:; LCSC Part Name: 100nF ±10% 16V; Supplier Part: C1525; Manufacturer: SAMSUNG(三星); Supplier Footprint: 0402; JLCPCB Part Class: Basic Part; Datasheet: https://atta.szlcsc.com/upload/public/pdf/source/20160218/1457707763339.pdf; Supplier: LCSC; Tolerance: ±10%
CHRG = XL-1005UGC_C965793: Illumination Color:Emerald Green Voltage - Forward(Vf):3V Voltage - Forward(Vf):3V Power(Watts):80mW Forward Current:25mA Wavelength - Dominant:516nm~531nm Wavelength - Dominant:516nm~531nm Peak Wavelength:531nm Lens Color:Water Clear Color Temperature:-; Supplier Part: C965793; Manufacturer: XINGLIGHT(成兴光); Supplier Footprint: 0402; JLCPCB Part Class: Extended Part; Datasheet: https://item.szlcsc.com/datasheet/XL-1005UGC/1051402.html; Supplier: LCSC; Illumination Color: Emerald Green; Voltage - Forward(Vf): 3V; Power(Watts): 80mW; Forward Current: 25mA; Wavelength - Dominant: 516nm~531nm; Peak Wavelength: 531nm; Lens Color: Water Clear; Luminous Intensity: 249mcd; Viewing Angle: 120°; Mounting Style: op View Mount
D1 D3 D4 D10-D12 = AZ5825-01F: Supplier: LCSC; Supplier Part: C2905641; Manufacturer: TECH PUBLIC(台舟); JLCPCB Part Class: Extended Part; Check: true
F1 = SMD1206P250TF: Voltage - Max:6V Current - Max:35A Hold Current:2.5A Trip Current:5A Power Dissipation:800mW Resistance - Initial (Ri) (Min):10mΩ Resistance - Post Trip (R1) (Max):60mΩ Time to Trip(Max):2s Operating Temperature:-40℃~+85℃ Operating Temperature:-40℃~+85℃ L; LCSC Part Name: 6V 2.5A 1206自恢复; Supplier Part: C20803; Manufacturer: RUILON(瑞隆源); Supplier Footprint: 1206; JLCPCB Part Class: Extended Part; Datasheet: https://item.szlcsc.com/datasheet/SMD1206P250TF/21515.html; Supplier: LCSC; Voltage - Max: 6V; Current - Max: 35A; Hold Current: 2.5A; Trip Current: 5A; Power Dissipation: 800mW; Resistance - Initial (Ri) (Min): 10mΩ; Resistance - Post Trip (R1) (Max): 60mΩ; Time to Trip(Max): 2s; Operating Temperature: -40℃~+85℃; Length: 3.6mm; Width: 1.9mm; Height: 1mm
L1 = FXL0420-2R2-M: Inductance:2.2uH Tolerance:±20% Tolerance:±20% Current Rating:4.5A Current - Saturation(Isat):5A DC Resistance(DCR):58mΩ Type:Molded Inductor; LCSC Part Name: 2.2uH ±20% 5A; Supplier Part: C167206; Manufacturer: cjiang(长江微电); Supplier Footprint: SMD,4.2x4.4mm; JLCPCB Part Class: Extended Part; Datasheet: https://atta.szlcsc.com/upload/public/pdf/source/20250421/DC75C633ACB13F952A25DE8912719752.pdf; Supplier: LCSC; Tolerance: ±20%; Current Rating: 4.5A; Current - Saturation(Isat): 5A; DC Resistance(DCR): 58mΩ; Type: Molded Inductor
R31 R32 = 0402WGF5101TCE: Type:Thick Film Resistor Resistance:5.1kΩ Tolerance:±1% Tolerance:±1% Power(Watts):62.5mW Voltage-Supply(Max):50V Temperature Coefficient:±100ppm/℃ Temperature Coefficient:±100ppm/℃ Operating Temperature:-55℃~+155℃ Operating Temperature:-55℃~+155℃; LCSC Part Name: 5.1kΩ ±1% 62.5mW 厚膜电阻; Supplier Part: C25905; Manufacturer: UNI-ROYAL(厚声); Supplier Footprint: 0402; JLCPCB Part Class: Basic Part; Datasheet: https://item.szlcsc.com/datasheet/0402WGF5101TCE/26648.html; Supplier: LCSC; Type: Thick Film Resistor; Tolerance: ±1%; Power(Watts): 62.5mW; Voltage-Supply(Max): 50V; Temperature Coefficient: ±100ppm/℃; Operating Temperature: -55℃~+155℃
R33 = RC0402FR-07270RL: Type:Thick Film Resistors Resistance: Tolerance:±1% Tolerance:±1% Power(Watts): Overload Voltage (Max): Temperature Coefficient:±100ppm/℃ Temperature Coefficient:±100ppm/℃ Operating Temperature Range:-55℃~+155℃ Operating Temperature Range:-55℃~+155℃; LCSC Part Name: 厚膜电阻 270Ω ±1% 62.5mW; Supplier Part: C163474; Manufacturer: YAGEO(国巨); Supplier Footprint: 0402; JLCPCB Part Class: Extended Part; Datasheet: https://atta.szlcsc.com/upload/public/pdf/source/20181009/C309620_DA5935B6E1D48212CB7A533FE518B3C2.pdf; Supplier: LCSC; Type: Thick Film Resistors; Tolerance: ±1%; Temperature Coefficient: ±100ppm/℃; Operating Temperature Range: -55℃~+155℃
R36 = RMC04022.2K1%N: Resistance: Tolerance:±1% Tolerance:±1% Power(Watts):; LCSC Part Name: 2.2kΩ ±1% 62.5mW; Supplier Part: C325418; Manufacturer: Tyohm(幸亚电阻); Supplier Footprint: 0402; JLCPCB Part Class: Extended Part; Datasheet: https://atta.szlcsc.com/upload/public/pdf/source/20190115/C325956_D27151D492FFB3C9AB4A6F14FE01F30A.pdf; Supplier: LCSC; Tolerance: ±1%
R38 = RC0402FR-07100KL: Type:Thick Film Resistor Resistance:100kΩ Tolerance:±1% Tolerance:±1% Power(Watts):62.5mW Voltage-Supply(Max):50V Temperature Coefficient:±100ppm/℃ Temperature Coefficient:±100ppm/℃ Operating Temperature:-55℃~+155℃ Operating Temperature:-55℃~+155℃; LCSC Part Name: 厚膜电阻 100kΩ ±1% 62.5mW; Supplier Part: C60491; Manufacturer: YAGEO(国巨); Supplier Footprint: 0402; JLCPCB Part Class: Extended Part; Datasheet: https://atta.szlcsc.com/upload/public/pdf/source/20250610/89E4D743C004A82A45145C7A2CC3A578.pdf; Supplier: LCSC; Type: Thick Film Resistor; Tolerance: ±1%; Power(Watts): 62.5mW; Voltage-Supply(Max): 50V; Temperature Coefficient: ±100ppm/℃; Operating Temperature: -55℃~+155℃
U11 = BQ25895RTWR: Supplier Part: C80200; Manufacturer: TI(德州仪器); Supplier Footprint: QFN-24-EP(4x4); JLCPCB Part Class: Extended Part; Datasheet: https://www.ti.com/cn/lit/gpn/bq25895; Supplier: LCSC
USB1 = TYPE-C 16PIN 2MD(073): Connector Type:Type-C Protocol Standard:- Gender:Female Mounting Type:Surface Mount, Right Angle Number of Contacts:16P Number of Ports:1 Current Rating-Power:3A Voltage Rating:5V Connect-Disconnect Life:5,000 Cycles Supplementary Features:- Center Height; LCSC Part Name: Type-C 母 卧贴; Supplier Part: C2765186; Manufacturer: SHOU HAN(首韩); Supplier Footprint: SMD; JLCPCB Part Class: Extended Part; Datasheet: https://item.szlcsc.com/datasheet/TYPE-C%252016PIN%25202MD(073)/2901843.html; Supplier: LCSC; Connector Type: Type-C; Gender: Female; Mounting Type: Surface Mount, Right Angle; Number of Contacts: 16P; Number of Ports: 1; Current Rating-Power: 3A; Voltage Rating: 5V; Connect-Disconnect Life: 5,000 Cycles; Detection color: Black; Operating Temperature: -25℃~+85℃
USB2 = 10.0 QHHTZB6.3: Connector Type:Type-A Protocol Standard:USB 2.0 Gender:Female Mounting Type:Surface Mount, Right Angle Number of Contacts:4P Number of Ports:1 Current Rating-Power:1.5A Voltage Rating:30V Connect-Disconnect Life:5,000 Cycles Supplementary Features:- Cente; LCSC Part Name: Type-A 母 卧贴; Supplier Part: C668591; Manufacturer: SHOU HAN(首韩); Supplier Footprint: SMD; JLCPCB Part Class: Extended Part; Datasheet: https://item.szlcsc.com/datasheet/10.0%2520QHHTZB6.3/698534.html; Supplier: LCSC; Connector Type: Type-A; Protocol Standard: USB 2.0; Gender: Female; Mounting Type: Surface Mount, Right Angle; Number of Contacts: 4P; Number of Ports: 1; Current Rating-Power: 1.5A; Voltage Rating: 30V; Connect-Disconnect Life: 5,000 Cycles; Length: 10mm; Detection color: Black; Operating Temperature: -25℃~+85℃
D7 = PESD5V0S1UL,315: polarity:Unidirectional Reverse Stand-Off Voltage (Vrwm):5V@Max Maximum Clamping Voltage:20V Peak Pulse Current (Ipp)@10/1000us:15A@8/20us Peak Pulse Power Dissipation (Ppp)@10/1000us:150W Breakdown Voltage:6.4V Type:TVS; Supplier Part: C85402; Manufacturer: Nexperia(安世); Supplier Footprint: SOD-882; JLCPCB Part Class: Extended Part; Datasheet: https://atta.szlcsc.com/upload/public/pdf/source/20191113/C456142_F14A4260CF3BEB8D903F5831E074AB74.pdf; Supplier: LCSC; polarity: Unidirectional; Reverse Stand-Off Voltage (Vrwm): 5V@Max; Maximum Clamping Voltage: 20V; Peak Pulse Current (Ipp)@10/1000us: 15A@8/20us; Peak Pulse Power Dissipation (Ppp)@10/1000us: 150W; Breakdown Voltage: 6.4V; Type: TVS
D8 = 1N5819WS_C191023: Forward Voltage (Vf@If):600mV@1A Reverse Voltage (Vr):40V Rectified Current:1A; LCSC Part Name: 电压:40V 电流:1A; Supplier Part: C191023; Manufacturer: Hottech(合科泰); Supplier Footprint: SOD-323; JLCPCB Part Class: Basic Part; Datasheet: https://atta.szlcsc.com/upload/public/pdf/source/20220428/3CB86FD8D28D653594B4E35F9D5AEFD9.pdf; Supplier: LCSC; Forward Voltage (Vf@If): 600mV@1A; Reverse Voltage (Vr): 40V; Rectified Current: 1A
R14 R20 R21 R27 R30 = 10K: Supplier Part: C98220; Supplier: LCSC; Manufacturer Part: RC0603FR-0710KL; TOLERANCE: 5%; Manufacturer: YAGEO; Check: true
SW_SLEEP/WAKE SW_VOLUME_DOWN SW_VOlUME_UP = TS24CA: Supplier: LCSC; Supplier Part: C393942; Manufacturer: SHOU HAN(首韩); JLCPCB Part Class: Extended Part; Check: true
U10 = GT-HD004A-PNNG0: Connector Type:HDMI-D Gender:Female Number of Pins:19P Mounting Style:Horizontal attachment Current Rating (Max):1A Rated Voltage (Max):24V Operating Temperature Range:-40℃~+85℃ Operating Temperature Range:-40℃~+85℃; LCSC Part Name: 板上19pin HDMI DF前插后贴母座; Supplier Part: C27636752; Manufacturer: G-Switch(品赞); Supplier Footprint: SMD; JLCPCB Part Class: Extended Part; Datasheet: https://atta.szlcsc.com/upload/public/pdf/source/20250108/179803C09D1B5CD23D8E188BBAB0C6C4.pdf; Supplier: LCSC; Connector Type: HDMI-D; Gender: Female; Number of Pins: 19P; Mounting Style: Horizontal attachment; Current Rating (Max): 1A; Rated Voltage (Max): 24V; Operating Temperature Range: -40℃~+85℃; Check: true
CARD1 = SMN-303: Supplier: LCSC; Supplier Part: C266888; Manufacturer: XUNPU(讯普); JLCPCB Part Class: Extended Part; Check: true
CN2 = AS0BC21-S30BB-7H: Supplier Part: C2761344; Manufacturer: FOXCONN(富士康); Supplier Footprint: SMD,P=0.5mm,卧贴; JLCPCB Part Class: Extended Part; Datasheet: https://atta.szlcsc.com/upload/public/pdf/source/20210319/C2761342_D2293F5FD33DE8C4EE27F5BB0655C6EA.pdf; Supplier: LCSC; Check: true
D5 = DT1042-04SO-7: Reverse Stand-Off Voltage (Vrwm):5V Maximum Clamping Voltage:9V Peak Pulse Power Dissipation (Ppp):55W Breakdown Voltage:6.2V Number of Lines:Four channels Operating Temperature:-55℃~+85℃@(Ta) Operating Temperature:-55℃~+85℃@(Ta) Type:ESD; Supplier Part: C460064; Manufacturer: DIODES(美台); Supplier Footprint: SOT-26; JLCPCB Part Class: Extended Part; Datasheet: https://atta.szlcsc.com/upload/public/pdf/source/20191129/C460064_2805D67BFF10BA05F1ABB14B65351125.pdf; Supplier: LCSC; Reverse Stand-Off Voltage (Vrwm): 5V; Maximum Clamping Voltage: 9V; Peak Pulse Power Dissipation (Ppp): 55W; Breakdown Voltage: 6.2V; Number of Lines: Four channels; Operating Temperature: -55℃~+85℃@(Ta); Type: ESD; Check: true
LED_SIM_STATUS1 = LED-0805_B: Manufacturer: 方舟 ARKLED; Manufacturer Part: D-B080508B1-KS2; Supplier Part: C108412; Check: true
R43 = 0805W8F3300T5E: Type:Thick Film Resistor Resistance:330Ω Tolerance:±1% Tolerance:±1% Power(Watts):125mW Voltage-Supply(Max):150V Temperature Coefficient:±100ppm/℃ Temperature Coefficient:±100ppm/℃ Operating Temperature:-55℃~+155℃ Operating Temperature:-55℃~+155℃; LCSC Part Name: 330Ω ±1% 125mW 厚膜电阻; Supplier Part: C17630; Manufacturer: UNI-ROYAL(厚声); Supplier Footprint: 0805; JLCPCB Part Class: Basic Part; Datasheet: https://item.szlcsc.com/datasheet/0805W8F3300T5E/18318.html; Supplier: LCSC; Type: Thick Film Resistor; Tolerance: ±1%; Power(Watts): 125mW; Voltage-Supply(Max): 150V; Temperature Coefficient: ±100ppm/℃; Operating Temperature: -55℃~+155℃

## Nets
+5V: C4.2 C7.1 C8.2 C10.2 C19.2 Camera_Switch.1 D8.2(A) D12.2(A) JP1.77 JP1.79 JP1.81 JP1.83 JP1.85 JP1.87 R36.2 U1.6(VDD) U11.23(PMID) USB2.1(VCC)
GND: BATTERY3.7v1.2(GND) C1.1 C3.1 C4.1 C5.1 C7.2 C8.1 C10.1 C12.1 C13.1 C15.1 C16.1 C17.1 C19.1 Camera_Switch.4 CARD1.8(EP) CARD1.9(EP) CARD1.10(EP) CARD1.11(EP) CARD1.C5(GND) CN1.4 CN1.5 CN2.3 CN2.5 CN2.11 CN2.27 CN2.33 CN2.39 CN2.45 CN2.51 CN2.57 CN2.71 CN2.73 D1.1(C) D3.1(C) D4.1(C) D5.2(VSS) D5.5(VCC) D7.1(C) D10.1(C) D11.1(C) D12.1(C) GND.1 H1.1 JP1.1 JP1.2 JP1.7 JP1.8 JP1.13 JP1.14 JP1.22 JP1.23 JP1.32 JP1.33 JP1.42 JP1.43 JP1.52 JP1.53 JP1.59 JP1.60 JP1.65 JP1.66 JP1.71 JP1.74 JP1.98 JP2.7 JP2.8 JP2.13 JP2.14 JP2.19 JP2.20 JP2.25 JP2.26 JP2.31 JP2.32 JP2.37 JP2.38 JP2.44 JP2.50 JP2.55 JP2.56 JP2.61 JP2.62 JP2.67 JP2.68 JP2.73 JP2.74 JP2.79 JP2.80 JP2.85 JP2.86 JP2.91 JP2.92 JP2.97 JP2.98 JP3.1 JP3.2 JP3.7 JP3.13 JP3.14 JP3.17 JP3.20 JP3.23 MIC_INPUT.2(-) Mic_switch.4 R1.1 R2.1 R3.1 R7.1 R14.1 R20.1 R21.1 R31.1 R32.1 R33.1 R35.1 R38.2 SW_SLEEP/WAKE.1 SW_SLEEP/WAKE.2 SW_VOLUME_DOWN.1 SW_VOLUME_DOWN.2 SW_VOlUME_UP.1 SW_VOlUME_UP.2 U1.7(GND) U10.1(TMDS_DATA2_SHIELD) U10.4(TMDS_DATA1_SHIELD) U10.7(TMDS_DATA0_SHIELD) U10.10(TMDS_CLOCK_SHIELD) U10.13(DDC/CEC_GND) U10.20(SHELL) U10.21(SHELL) U11.17(PGND) U11.18(PGND) U11.25(PAD) USB1.1(GND) USB1.12(GND) USB1.13(SHELL) USB1.14(SHELL) USB2.4(GND) USB2.5 USB2.6
VBAT: BATTERY3.7v1.1(VCC) C16.2 U11.13(BAT) U11.14(BAT)
VCC_1V8: JP1.88 JP1.90
VCC_3V3: JP1.84 JP1.86 LED_SIM_STATUS1.1 Mic_switch.3 R27.1 R30.2 R41.2 R42.2 SW_SLEEP/WAKE.4 SW_VOLUME_DOWN.4 SW_VOlUME_UP.4
BTST: C18.2 U11.21(BTST)
CARD_DETECT: CARD1.CD CN2.64
CE: R38.1 U11.9(CE)
GPIO0_D0(UART2_RX_M0): JP1.51 R26.1
GPIO0_D1(UART2_TX_M0): JP1.55 R25.1
GPIO3_D1: JP1.25 R14.2 SW_VOLUME_DOWN.3
GPIO3_D2: JP1.27 R20.2 SW_VOlUME_UP.3
GPIO3_D5: JP1.29 R21.2 SW_SLEEP/WAKE.3
HDMI_CEC_PORT: D7.2(A) JP2.51 R30.1 U10.14(CEC)
HDMI_TX0_N: JP2.84 U10.9(TMDS_DATA0-)
HDMI_TX0_P: JP2.82 U10.8(TMDS_DATA0+)
HDMI_TX1_N: JP2.78 U10.6(TMDS_DATA1-)
HDMI_TX1_P: JP2.76 U10.5(TMDS_DATA1+)
HDMI_TX2_N: JP2.72 U10.3(TMDS_DATA2-)
HDMI_TX2_P: JP2.70 U10.2(TMDS_DATA2+)
HDMI_TX_HPD_PORT: JP2.53 U10.19(HP_DETECT)
HDMI_TXCLK_N: JP2.90 U10.12(TMDS_CLOCK-)
HDMI_TXCLK_P: JP2.88 U10.11(TMDS_CLOCK+)
HDMI_TXDDC_SCL_PORT: JP2.100 U10.15(SCL)
HDMI_TXDDC_SDA_PORT: JP2.99 U10.16(SDA)
HP_SNS: JP3.8 R3.2 U9.1
HPL_OUT: JP3.6 R2.2 U9.2
HPR_OUT: C2.1 JP3.4 R1.2 U9.3
ILIM: R33.2 U11.10(ILIM)
LED1#: CN2.10 R43.1
MIC1_IN: JP3.10 MIC_INPUT.1(+) R4.1 R9.1 U9.4
MIPI_CSI_RX_D2N: JP2.28 JP2.33
MIPI_CSI_RX_D2P: JP2.30 JP2.35
MIPI_CSI_RX_D3N: JP2.34 JP2.39
MIPI_CSI_RX_D3P: JP2.36 JP2.41
OTG: R37.2 U11.8(OTG)
PMIC_PWRON: JP1.99 WAKE.1
REGN: C15.2 R34.2 U11.22(REGN)
SARADC_VIN1: C5.2 JP1.70 R4.2 R7.2
SCL: JP1.35 R42.1 U11.5(SCL)
SDA: JP1.36 R41.1 U11.6(SDA)
SPEAKER+: SPEAKER.1(+) U1.8(VO2)
SPEAKER-: R11.1 SPEAKER.2(-) U1.5(VO1)
STATUS: CHRG.1(K) U11.4(STAT)
SW: C18.1 L1.1 U11.19(SW) U11.20(SW)
SYS: C12.2 C13.2 CN2.2 CN2.4 CN2.70 CN2.72 CN2.74 L1.2 R37.1 U11.15(SYS) U11.16(SYS)
TS: R34.1 R35.2 U11.11(TS)
USB2_0_OTG_DM: D10.2(A) JP2.3 USB2.2(D-)
USB2_0_OTG_DP: D11.2(A) JP2.5 USB2.3(D+)
USB2_DN: D4.2(A) U11.3(D–) USB1.5(DN2) USB1.7(DN1)
USB2_DP: D3.2(A) U11.2(D+) USB1.6(DP1) USB1.8(DP2)
USB2_HOST2_N: CN1.2 JP3.9
USB2_HOST2_P: CN1.3 JP3.11
USB2_HOST3_N: JP3.3
USB2_HOST3_P: JP3.5
USB3_HOST1_N: CN2.9 JP3.19
USB3_HOST1_P: CN2.7 JP3.21
USIM_CLK: CARD1.C3(CLK) CN2.32 D5.6(I/O4)
USIM_DATA: CARD1.C7(I/O) CN2.34 D5.4(I/O3)
USIM_RST: CARD1.C2(RST) CN2.30 D5.3(I/O2)
USIM_VDD: CARD1.C1(VCC) CN2.36 D5.1(I/O1)
V_USB: C17.2 D1.2(A) F1.2 U11.1(VBUS)
$1N4419: H1.3 R25.2
$1N4460: H1.2 R26.2
$2N2: CAMERA_ON.1 Camera_Switch.2 CN1.1
$2N7: C3.2 U1.2(BYPASS) U1.3(IN+)
$2N10: R10.2 R11.2 U1.4(IN-)
$2N12: C1.2 R8.1 R9.2
$2N528: C2.2 R10.1
$2N1557: Mic_switch.2 R8.2
$3N6118: CN2.23 R27.2 RING_IND1.1
$3N9431: LED_SIM_STATUS1.2 R43.2
$5N5817: D8.1(K) U10.18(+5V)
$6N34185: CHRG.2(A) R36.1
$6N55425: F1.1 USB1.2(VBUS) USB1.11(VBUS)
$6N55448: R32.2 USB1.4(CC1)
$6N55522: R31.2 USB1.10(CC2)

Not connected (* = marked no-connect by the designer): Camera_Switch 3*; CARD1 C6(VPP)*; CN1 6* 7*; CN2 1 6 8 20 21 22 24 25 26 28 29* 31* 35* 37* 38* 40 41* 42 43* 44 46 47* 48 49* 50 52 53* 54 55* 56 58 59 60 61 62 63 65 66 67 68* 69 75 76 77; JP1 3* 4* 5* 6* 9* 10* 11* 12* 15* 16* 17* 18* 19* 20* 21* 24* 26* 28* 30* 31* 34* 37* 38* 39* 40* 41* 44* 45* 46* 47* 48* 49* 50* 54* 56* 57* 58* 61* 62* 63* 64* 67* 68* 69* 72* 73* 75* 76* 78* 80* 82* 89* 91* 92* 93* 94* 95* 96* 97* 100*; JP2 1* 2* 4* 6* 9* 10* 11* 12* 15* 16* 17* 18* 21* 22* 23* 24* 27* 29* 40* 42* 43* 45* 46* 47* 48* 49* 52* 54* 57* 58* 59* 60* 63* 64* 65* 66* 69* 71* 75* 77* 81* 83* 87* 89* 93* 94* 95* 96*; JP3 12* 15* 16* 18* 22* 24*; Mic_switch 1*; U1 1(SD#)*; U10 17(UTILITY)*; U11 7(INT)* 12(QON)* 24(DSEL)*; USB1 3(SBU2)* 9(SBU1)*

## Notes on the sheets
sheet 1
- OPI CM4 CONNECTORS
sheet 2
- SPEAKER CIRCUIT
- HEAD PHONE CIRCUIT
- MICRO PHONE CIRCUIT
- USB2_CAMERA_CONNECTOR
sheet 3
- SIM CARD HOLDER
- SIM MODULE
- M.2 Connector
- STATUS LEDS
sheet 4
- HDMI PORT
- PUSH BUTTONS
sheet 5
- Type C Charging Port
- Power Management IC
- At 5V VBUS, REGN is 4.8V
- Labels:
  USB2_HOST2_P
  USB2_HOST2_N
- USB Type-A Receptacle
